# EAGLE schematic Secondary Board Schematic 2 v2 (EAGLE 9.7.0)
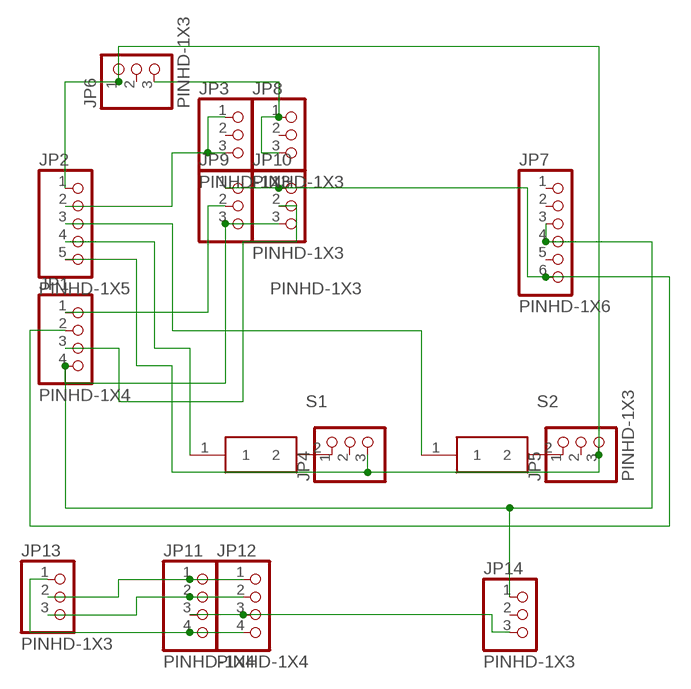
[diagram p0: schematic, sheet 1]

## Parts
JP1  PINHD-1X4  [1X04]
JP2  PINHD-1X5  [1X05]
JP3  PINHD-1X3  [1X03]
JP4  PINHD-1X3  [1X03]
JP5  PINHD-1X3  [1X03]
JP6  PINHD-1X3  [1X03]
JP7  PINHD-1X6  [1X06]
JP8  PINHD-1X3  [1X03]
JP9  PINHD-1X3  [1X03]
JP10  PINHD-1X3  [1X03]
JP11  PINHD-1X4  [1X04]
JP12  PINHD-1X4  [1X04]
JP13  PINHD-1X3  [1X03]
JP14  PINHD-1X3  [1X03]
S1  MX1A-E1NW  [MX1AE1NW]
S2  MX1A-E1NW  [MX1AE1NW]

## Nets
N$1: JP1.4 JP7.3 JP7.4 JP9.3 JP10.3 JP14.1
N$2: JP1.2 JP7.6 JP9.1 JP10.1
N$3: JP4.1 S1.2
N$4: JP5.1 S2.2
N$5: JP1.1 JP9.2
N$6: JP6.3 JP8.1 JP8.3
N$7: JP2.1 JP2.5 JP4.3 JP5.3 JP6.1
N$8: JP2.3 S2.1
N$9: JP2.4 S1.1
N$10: JP1.3 JP10.2
N$11: JP2.2 JP3.1 JP3.3
N$12: JP11.3 JP12.3 JP14.3
N$13: JP11.2 JP12.2 JP13.3
N$14: JP11.1 JP12.1 JP13.2
N$15: JP11.4 JP12.4 JP13.1
Unconnected: JP3.2 JP4.2 JP5.2 JP6.2 JP7.1 JP7.2 JP7.5 JP8.2 JP14.2

## Library data of the parts
JP1 JP11 JP12 = Connector:PINHD-1X4: PIN HEADER; CATEGORY: CONNECTOR; SUB-CATEGORY: PIN-HEADER
JP2 = Connector:PINHD-1X5: PIN HEADER; CATEGORY: CONNECTOR; SUB-CATEGORY: PIN-HEADER
JP3-JP6 JP8-JP10 JP13 JP14 = Connector:PINHD-1X3: PIN HEADER; CATEGORY: CONNECTOR; SUB-CATEGORY: PIN-HEADER
JP7 = Connector:PINHD-1X6: PIN HEADER; CATEGORY: CONNECTOR; SUB-CATEGORY: PIN-HEADER
S1 S2 = SamacSys_Parts:MX1A-E1NW: Pushbutton Switches Full Travel, Mech. Keyswitch, Click Tactile Feel (Blue stem), 60cN, No LED, No Diode, Fixation Pins for PCB Mounting Source: Datasheet <https://media.digikey.com/pdf/Data Sheets/Cherry PDFs/MX Series.pdf>; DESCRIPTION: Pushbutton Switches Full Travel, Mech. Keyswitch, Click Tactile Feel (Blue stem), 60cN, No LED, No Diode, Fixation Pins for PCB Mounting; HEIGHT: 15.2mm; MANUFACTURER_NAME: Cherry; MANUFACTURER_PART_NUMBER: MX1A-E1NW; MOUSER_PART_NUMBER: 540-MX1A-E1NW; MOUSER_PRICE-STOCK: https://www.mouser.co.uk/ProductDetail/CHERRY/MX1A-E1NW/?qs=Z7NFYKyvgJd45Wm4xzFv7w%3D%3D